# Altium schematic sheet Fuente 50V-2A.SchDoc
size A3; SheetNumber: 1; SheetTotal: 1
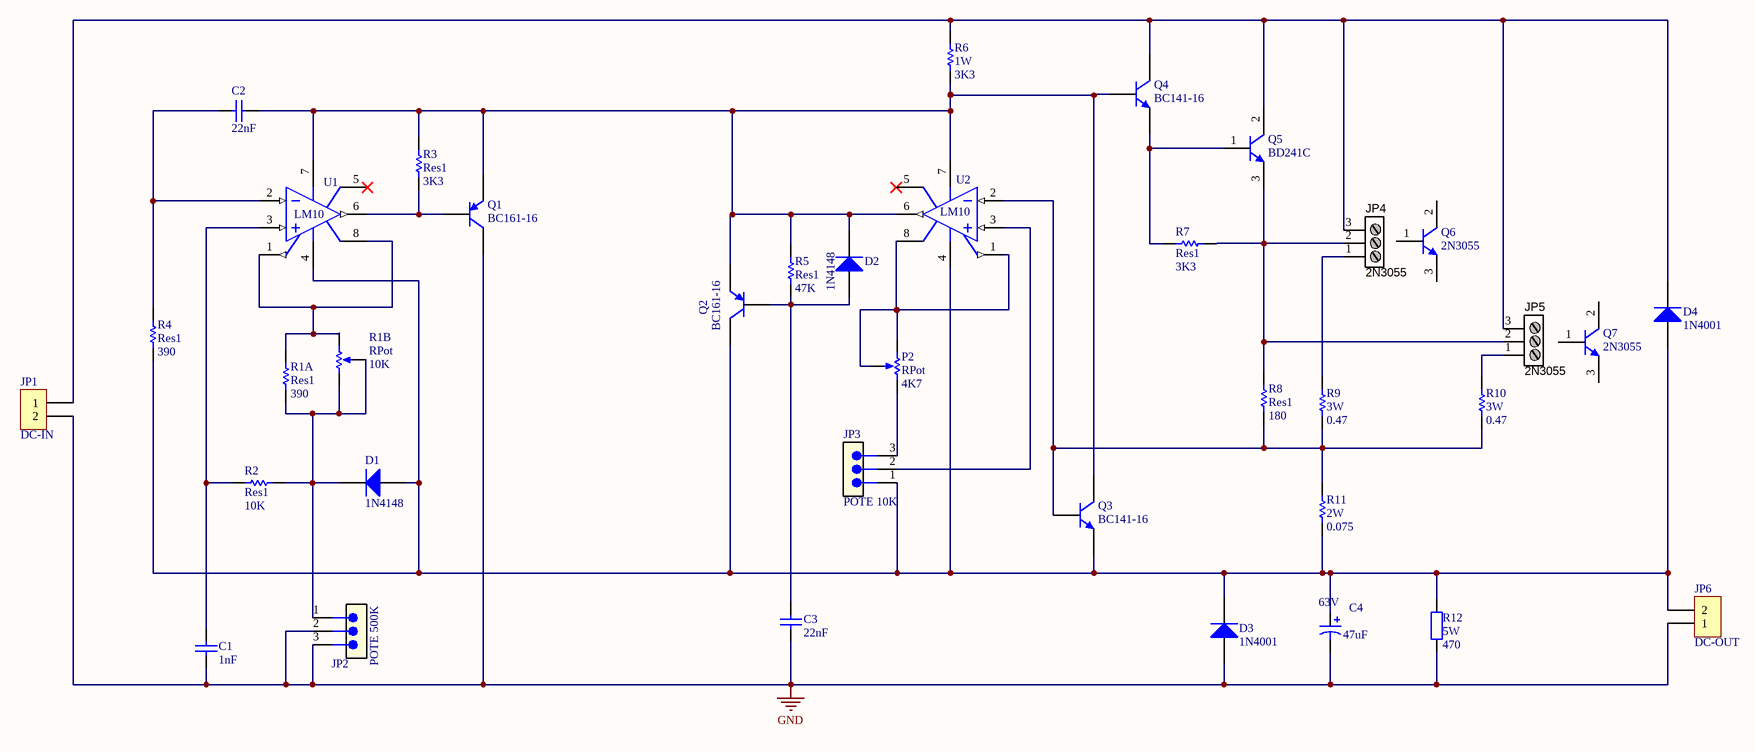
[diagram p0: Fuente 50V-2A.SchDoc]

## Parts
C1  1nF  [VP41-2.5]
C2  value 22nF  [HA-N3]  (hidden comment: HA3.3-3N3RM)
C3  22nF  [VP41-2.5]
C4  47uF  value 63V  [HA-C9]
D1  1N4148  [DO-35]
D2  1N4148  [DO-35]
D3  1N4001  [DO-41]
D4  1N4001  [DO-41]
JP1  DC-IN  [CONECTEUR 2POS - duplicate]
JP2  POTE 500K  [HEADER3X1]
JP3  POTE 10K  [HEADER3X1]
JP4  2N3055  [ficha 1X3]
JP5  2N3055  [ficha 1X3]
JP6  DC-OUT  [CONECTEUR 2POS - duplicate]
P2  RPot  value 4K7  [VR5]
Q1  BC161-16  [79-04]
Q2  BC161-16  [79-04]
Q3  BC141-16  [79-04]
Q4  BC141-16  [79-04]
Q5  BD241C  [ONSC-TO-220-3-221A-09]
Q6  2N3055  [ONSC-TO-220-3-221A-09]
Q7  2N3055  [ONSC-TO-220-3-221A-09]
R1A  Res1  value 390  [AXIAL-0.3]
R1B  RPot  value 10K  [VR5]
R2  Res1  value 10K  [AXIAL-0.3]
R3  Res1  value 3K3  [AXIAL-0.3]
R4  Res1  value 390  [AXIAL-0.3]
R5  Res1  value 47K  [AXIAL-0.3]
R6  1W  value 3K3  [AXIAL-0.5]
R7  Res1  value 3K3  [AXIAL-0.3]
R8  Res1  value 180  [AXIAL-0.3]
R9  3W  value 0.47  [AXIAL-0.5]
R10  3W  value 0.47  [AXIAL-0.5]
R11  2W  value 0.075  [AXIAL-0.5]
R12  5W  value 470  [AXIAL-0.4]
U1  LM10  [N8]
U2  LM10  [N8]

## Nets
GND: C1.1 C3.1 C4.2 D3.1(A) JP1.2 JP2.2 JP2.3 JP6.1 Q1.3(C) R12.1
NetC1_2: C1.2 R2.2 U1.3(IN+)
NetC2_1: C2.1 D2.2(K) Q1.1(E) Q2.1(E) Q3.3(C) Q4.2(B) R3.1 R5.2 R6.1 U1.7(V+) U2.6(OUT) U2.7(V+)
NetC2_2: C2.2 R4.2 U1.2(IN-)
NetC3_2: C3.2 D2.1(A) Q2.2(B) R5.1
NetC4_1: C4.1 D1.1(A) D3.2(K) D4.1(A) JP3.1 JP6.2 Q2.3(C) Q3.1(E) R4.1 R11.1 R12.2 U1.4(V-) U2.4(V-)
NetD1_2: D1.2(K) JP2.1 R1A.1 R1B.1 R1B.2 R2.1
NetD4_2: D4.2(K) JP1.1 JP4.3 JP5.3 Q4.3(C) Q5.2(C) R6.2
NetJP3_2: JP3.2 U2.3(IN+)
NetJP3_3: JP3.3 P2.3
NetJP4_1: JP4.1 R9.2
NetJP4_2: JP4.2 JP5.2 Q5.3(E) R7.2 R8.2
NetJP5_1: JP5.1 R10.2
NetP2_1: P2.1 P2.2 U2.1(REFOUT) U2.8(REF_FBK)
NetQ1_2: Q1.2(B) R3.2 U1.6(OUT)
NetQ3_2: Q3.2(B) R8.1 R9.1 R10.1 R11.2 U2.2(IN-)
NetQ4_1: Q4.1(E) Q5.1(B) R7.1
NetR1A_2: R1A.2 R1B.3 U1.1(REFOUT) U1.8(REF_FBK)

Not connected (* = marked no-connect by the designer): Q6 1(B) 2(C) 3(E); Q7 1(B) 2(C) 3(E); U1 5(BAL)*; U2 5(BAL)*

## Library data of the parts
C1 = VP41BA102JB: Dipped Radial Multilayer Ceramic Capacitor COG (NPO): 1000pF, 100V; Note: See Datasheet for other packages & tolerances; Published: 17-Dec-2003; DatasheetDocument: 2-Jan-2002; PackageDocument: 8-Feb-2002; PackageReference: VP41-2.5; Publisher: Altium Limited; ComponentLink1Description: Manufacturer Link; ComponentLink1URL: http://www.vishay.com/; Value: 1nF
C2 = HA3.3-3N3RM: Subminiature, Leaded Solid Tantalum Capacitor: Radial-Lead, Non-Polarised, 3.3uF, 20% Tolerance, 3 WVDC @ +85°C; Note: See Data Sheet for full range of components; Published: 19-Mar-2004; DatasheetDocument: 13-Jun-2002; PackageReference: HA-N3; Publisher: Altium Limited; ComponentLink1Description: Manufacturer Link; ComponentLink1URL: http://www.vishay.com/; ComponentLink2Description: Datasheet; ComponentLink2URL: http://www.vishay.com/docs/43003/ha.pdf
C3 = VP41BA102JB: Dipped Radial Multilayer Ceramic Capacitor COG (NPO): 1000pF, 100V; Note: See Datasheet for other packages & tolerances; Value: 1nF; Published: 17-Dec-2003; DatasheetDocument: 2-Jan-2002; PackageDocument: 8-Feb-2002; PackageReference: VP41-2.5; Publisher: Altium Limited; ComponentLink1Description: Manufacturer Link; ComponentLink1URL: http://www.vishay.com/
C4 = HA33-4C9RM: Subminiature, Leaded Solid Tantalum Capacitor: Radial-Lead, Polarised, 33uF, 20% Tolerance, 4 WVDC @ +85°C; Note: See Data Sheet for full range of components; Published: 19-Mar-2004; DatasheetDocument: 13-Jun-2002; PackageReference: HA-C9; Publisher: Altium Limited; ComponentLink1Description: Manufacturer Link; ComponentLink1URL: http://www.vishay.com/; ComponentLink2Description: Datasheet; ComponentLink2URL: http://www.vishay.com/docs/43003/ha.pdf
D1 D2 = 1N4148: High Conductance Fast Diode; Published: 8-Jun-2000; LatestRevisionDate: 17-Jul-2002; LatestRevisionNote: Re-released for DXP Platform.; DatasheetDocument: 1997; PackageReference: DO-35; Publisher: Altium Limited; Code_JEDEC: DO-204-AH; ComponentLink1Description: Manufacturer Link; ComponentLink1URL: http://www.fairchildsemi.com/; ComponentLink2Description: Datasheet; ComponentLink2URL: http://www.fairchildsemi.com/ds/1N%2F1N4148.pdf
D3 D4 = Diode 1N4001: 1 Amp General Purpose Rectifier; Published: 8-Jun-2000; LatestRevisionDate: 17-Jul-2002; LatestRevisionNote: Re-released for DXP Platform.; DatasheetVersion: 1998; PackageVersion: Aug-1999; PackageReference: DO-41; Publisher: Altium Limited; PackageDescription: Diode, Axial; Body 5.2 x 2.7 mm (LxDia. max), Lead Dia. 0.86 mm (max); Code_JEDEC: DO-204-AL; ComponentLink1Description: Manufacturer Link; ComponentLink1URL: http://www.fairchildsemi.com/; ComponentLink2Description: Datasheet; ComponentLink2URL: http://www.fairchildsemi.com/ds/1N%2F1N4001.pdf
JP1 JP6 = CON 1x2: CONECTOR 2P
JP2 JP3 = HEADER 3X1
JP4 JP5 = ficha 1X4: Terminal Block Screw Type THT 2-Position 3.81mm pitch; Manufacturer 1: Tyco Electronics; Manufacturer Part Number 1: 1776113-2; Value: 2 position; Pitch: 0.150" (3.81mm); Positions Per Level: 2; Package / Case: Side Entry; 3.81mm pitch; Category: Connectors Interconnects; Color: Black; Supplier 1: Digi-Key
P2 R1B = RPot: Potentiometer; Sim Note: Enter the Resistance value and the set point into parameter fields.; Set Position: 0.5; Published: 8-Jun-2000; LatestRevisionDate: 17-Jul-2002; LatestRevisionNote: Re-released for DXP Platform.; PackageReference: VR5; Publisher: Altium Limited
Q1 Q2 = BC161-16: Amplifier Transistor PNP Silicon; Published: 29-Sep-2000; LatestRevisionDate: 17-Jul-2002; LatestRevisionNote: Re-released for DXP Platform.; DatasheetVersion: 1997; PackageVersion: 1997; PackageReference: 79-04; Publisher: Altium Limited; PackageDescription: Can; 3 Leads; Pin Circle Dia. 5.08 mm; Lead Dia. 0.48 mm (max); ComponentLink1Description: Manufacturer Link; ComponentLink1URL: http://www.onsemi.com/site/products/landing?taxonomyID=194
Q3 Q4 = BC141-16: Amplifier Transistor NPN Silicon; Published: 29-Sep-2000; LatestRevisionDate: 17-Jul-2002; LatestRevisionNote: Re-released for DXP Platform.; DatasheetVersion: 1991; PackageVersion: 1997; PackageReference: 79-04; Publisher: Altium Limited; PackageDescription: Can; 3 Leads; Pin Circle Dia. 5.08 mm; Lead Dia. 0.48 mm (max); ComponentLink1Description: Manufacturer Link; ComponentLink1URL: http://www.onsemi.com/site/products/landing?taxonomyID=194
Q5-Q7 = BD241C: Complementary Silicon Plastic Power Transistor, 3-Pin TO-220, Tube; Manufacturer: On Semiconductor; fT Min (MHz): 3; Polarity: NPN; DatasheetVersion: Rev. 9; PackageVersion: Rev. AG, 09/2011; PackageReference: TO-220-3-221A-09; PackageDescription: 3-Pin Flange Mount, Vertical Straight Lead, Body 9.97 x 4.445 mm, Pitch 2.54 mm; Supplier 1: Digi-Key; Supplier Part Number 1: BD241C-ND; IC Continuous (A): 3; Packing: Tube; RoHS: FALSE; Mounting Technology: Through Hole; PartNumber: BD241C; ComponentLink1Description: Manufacturer URL; ComponentLink1URL: http://www.onsemi.com/; ComponentLink2Description: Datasheet; ComponentLink2URL: http://www.onsemi.com/pub_link/Collateral/BD241C-D.PDF; ComponentLink3Description: Package Specification; ComponentLink3URL: http://www.onsemi.com/pub_link/Collateral/221A-09.PDF
R1A R2-R5 R7 R8 = Res1: Resistor; Published: 8-Jun-2000; LatestRevisionDate: 17-Jul-2002; LatestRevisionNote: Re-released for DXP Platform.; PackageReference: AXIAL-0.3; Publisher: Altium Limited; PackageDescription: Axial Device, Thru-Hole; 2 Leads; 0.3 in Pin Spacing
R6 R9-R11 = Res Semi: Semiconductor Resistor; Published: 8-Jun-2000; LatestRevisionDate: 17-Jul-2002; LatestRevisionNote: Re-released for DXP Platform.; PackageReference: AXIAL-0.5; Publisher: Altium Limited; PackageDescription: Axial Device, Thru-Hole; 2 Leads; 0.5 in Pin Spacing
R12 = Res2: Resistor; Published: 8-Jun-2000; LatestRevisionDate: 17-Jul-2002; LatestRevisionNote: Re-released for DXP Platform.; PackageReference: AXIAL-0.4; Publisher: Altium Limited; PackageDescription: Axial Device, Thru-Hole; 2 Leads; 0.4 in Pin Spacing
U1 U2 = LM10CN8: Low Power Operational Amplifier and Reference; Published: 8-Jun-2000; LatestRevisionDate: 06-Jun-2005; LatestRevisionNote: Stylized 3D Model Added.; DatasheetVersion: 1990; PackageVersion: N8 1002; PackageReference: N8; Publisher: Altium Limited; PackageDescription: DIP, Plastic; 8 Leads; Row Spacing 7.62 mm; Pitch 2.54 mm; ComponentLink1Description: Manufacturer Link; ComponentLink1URL: http://www.linear.com/; ComponentLink2Description: Datasheet; ComponentLink2URL: http://www.linear.com/pc/downloadDocument.do?navId=H0,C3,P2016,D1738